# Altium schematic sheet LTC6803-3.SchDoc
size A4
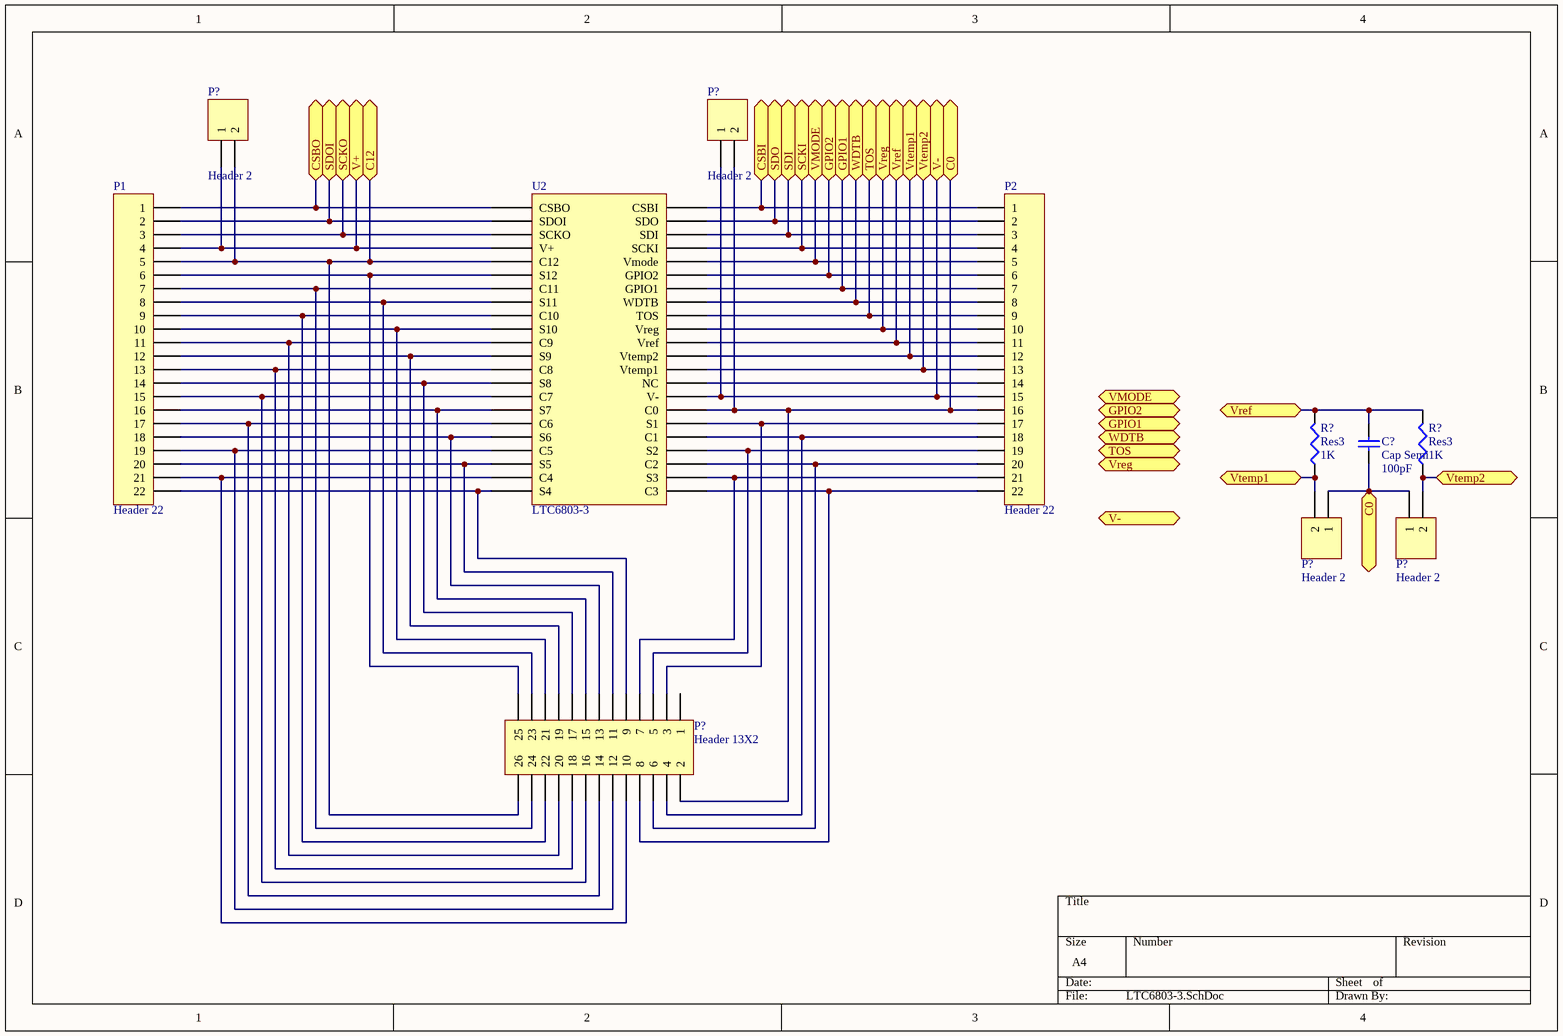
[diagram p0: LTC6803-3.SchDoc]

## Parts
(Parts that share a designator on the sheet are numbered #1, #2 ... from top to bottom, then left to right.)
C?  Cap Semi  value 100pF  [C1206]
P1  Header 22  [HDR1X22]
P2  Header 22  [HDR1X22]
P?#1  Header 2  [HDR1X2]
P?#2  Header 2  [HDR1X2]
P?#3  Header 2  [HDR1X2]
P?#4  Header 2  [HDR1X2]
P?#5  Header 13X2  [HDR2X13]
R?#1  Res3  value 1K  [J1-0603]
R?#2  Res3  value 1K  [J1-0603]
U2  LTC6803-3  [SOP44]

## Ports
C0, C12, CSBI, CSBO, GPIO1, GPIO2, SCKI, SCKO, SDI, SDO, SDOI, TOS, V+, V-, VMODE, Vref, Vreg, Vtemp1, Vtemp2, WDTB

## Nets
C0: C?.1 P2.16 P?#2.2 P?#3.1 P?#4.1 P?#5.2 U2.29(C0) ; port C0
C12: P1.5 P?#1.2 P?#5.26 U2.5(C12) ; port C12
CSBI: P2.1 U2.44(CSBI) ; port CSBI
CSBO: P1.1 U2.1(CSBO) ; port CSBO
GPIO1: P2.7 U2.38(GPIO1) ; port GPIO1
GPIO2: P2.6 U2.39(GPIO2) ; port GPIO2
SCKI: P2.4 U2.41(SCKI) ; port SCKI
SCKO: P1.3 U2.3(SCKO) ; port SCKO
SDI: P2.3 U2.42(SDI) ; port SDI
SDO: P2.2 U2.43(SDO) ; port SDO
SDOI: P1.2 U2.2(SDOI) ; port SDOI
TOS: P2.9 U2.36(TOS) ; port TOS
V+: P1.4 P?#1.1 U2.4(V+) ; port V+
V-: P2.15 P?#2.1 U2.30(V-) ; port V-
VMODE: P2.5 U2.40(Vmode) ; port VMODE
Vref: C?.2 P2.11 R?#1.2 R?#2.2 U2.34(Vref) ; port Vref
Vreg: P2.10 U2.35(Vreg) ; port Vreg
Vtemp1: P2.12 P?#3.2 R?#1.1 U2.33(Vtemp2) ; port Vtemp1
Vtemp2: P2.13 P?#4.2 R?#2.1 U2.32(Vtemp1) ; port Vtemp2
WDTB: P2.8 U2.37(WDTB) ; port WDTB
NetP1_6: P1.6 P?#5.25 U2.6(S12)
NetP1_7: P1.7 P?#5.24 U2.7(C11)
NetP1_8: P1.8 P?#5.23 U2.8(S11)
NetP1_9: P1.9 P?#5.22 U2.9(C10)
NetP1_10: P1.10 P?#5.21 U2.10(S10)
NetP1_11: P1.11 P?#5.20 U2.11(C9)
NetP1_12: P1.12 P?#5.19 U2.12(S9)
NetP1_13: P1.13 P?#5.18 U2.13(C8)
NetP1_14: P1.14 P?#5.17 U2.14(S8)
NetP1_15: P1.15 P?#5.16 U2.15(C7)
NetP1_16: P1.16 P?#5.15 U2.16(S7)
NetP1_17: P1.17 P?#5.14 U2.17(C6)
NetP1_18: P1.18 P?#5.13 U2.18(S6)
NetP1_19: P1.19 P?#5.12 U2.19(C5)
NetP1_20: P1.20 P?#5.11 U2.20(S5)
NetP1_21: P1.21 P?#5.10 U2.21(C4)
NetP1_22: P1.22 P?#5.9 U2.22(S4)
NetP2_14: P2.14 U2.31(NC)
NetP2_17: P2.17 P?#5.3 U2.28(S1)
NetP2_18: P2.18 P?#5.4 U2.27(C1)
NetP2_19: P2.19 P?#5.5 U2.26(S2)
NetP2_20: P2.20 P?#5.6 U2.25(C2)
NetP2_21: P2.21 P?#5.7 U2.24(S3)
NetP2_22: P2.22 P?#5.8 U2.23(C3)

Not connected (* = marked no-connect by the designer): P?#5 1

## Library data of the parts
C? = Cap Semi: Capacitor (Semiconductor SIM Model); Published: 8-Jun-2000; LatestRevisionDate: 29-May-2009; LatestRevisionNote: IPC-7351 Footprint Added.; PackageReference: C1206; Publisher: Altium Limited; PackageDescription: Chip Capacitor
P1 P2 = Header 22: Header, 22-Pin; LatestRevisionDate: 17-Jul-2002; LatestRevisionNote: Re-released for DXP Platform.; Publisher: Altium Limited
P?#1-P?#4 = Header 2: Header, 2-Pin; LatestRevisionDate: 17-Jul-2002; LatestRevisionNote: Re-released for DXP Platform.; Publisher: Altium Limited
P?#5 = Header 13X2: Header, 13-Pin, Dual row; LatestRevisionDate: 17-Jul-2002; LatestRevisionNote: Re-released for DXP Platform.; Publisher: Altium Limited
R?#1 R?#2 = Res3: Resistor; Published: 8-Jun-2000; LatestRevisionDate: 29-May-2009; LatestRevisionNote: IPC-7351 Footprint Added.; PackageReference: J1-0603; Publisher: Altium Limited; PackageDescription: Chip Resistor